# EAGLE design Kao Light Test Surface Mount (EAGLE 9.6.2)
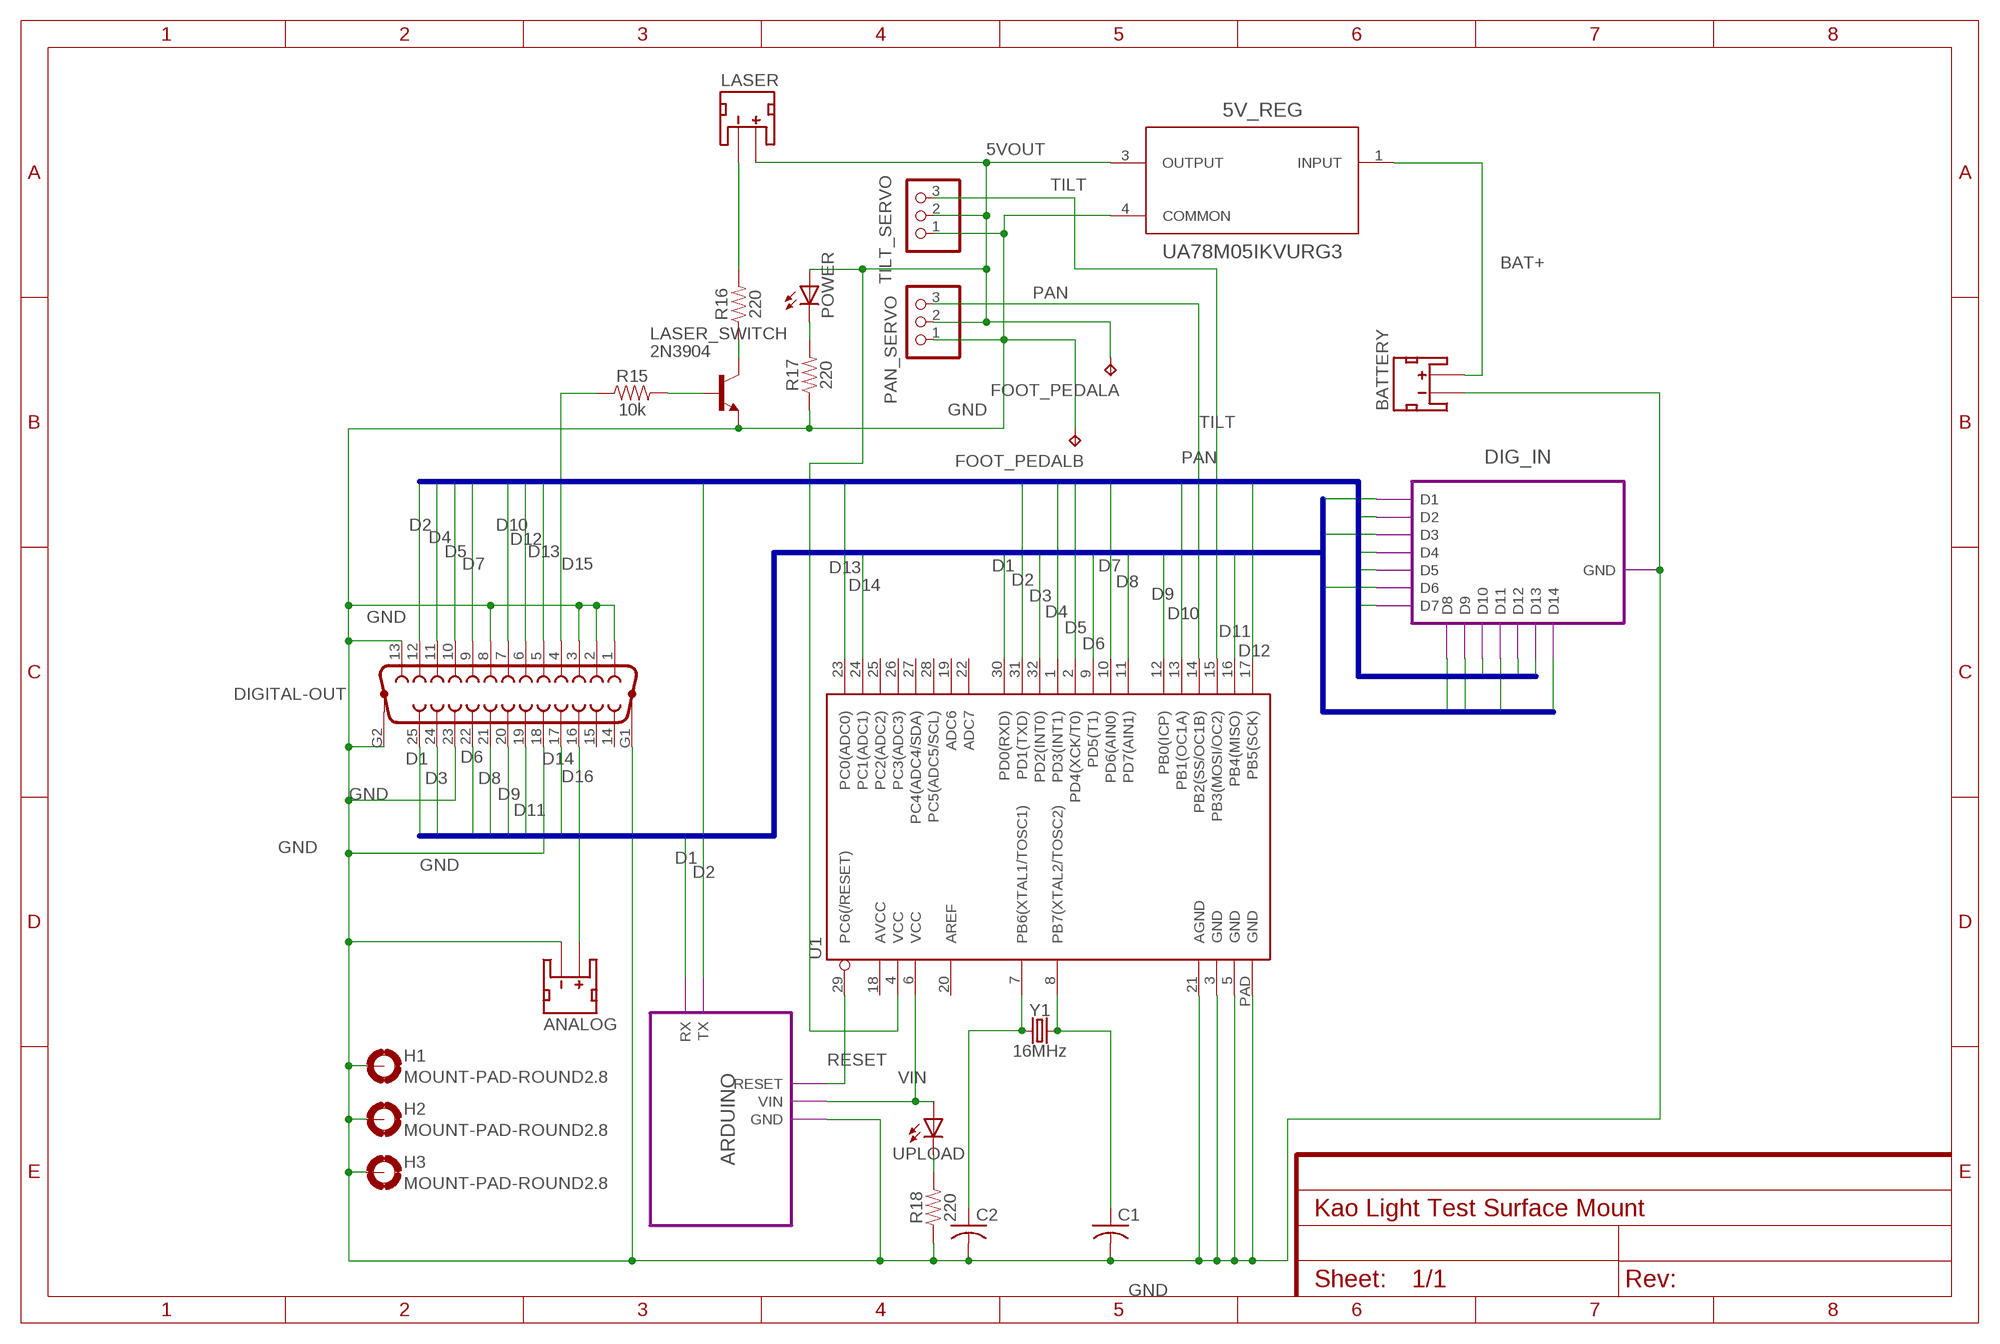
[diagram p0: schematic, sheet 1]

## Parts
5V_REG  UA78M05IKVURG3  [KVU0003A_N]
ANALOG  JST_2MM_MALE  [JST-2-SMD]
BATTERY  JST_2MM_MALE  [JST-2-SMD]
C1  C-USC0805K  [C0805K]
C2  C-USC0805K  [C0805K]
DIGITAL-OUT  F25VP  [F25VP]
FOOT_PEDAL  TP2P2-38-17  [P2-38-17]
H1  MOUNT-PAD-ROUND2.8  [2,8-PAD]
H2  MOUNT-PAD-ROUND2.8  [2,8-PAD]
H3  MOUNT-PAD-ROUND2.8  [2,8-PAD]
LASER  JST_2MM_MALE  [JST-2-SMD]
LASER_SWITCH  2N3904  2N2222  [TO92-EBC-OVAL]
PAN_SERVO  PINHD-1X3CB  [1X03-CLEANBIG]
POWER  LEDCHIPLED_0805  [CHIPLED_0805]
R15  10k  10KOHM-0603-1/10W-1%  [0603]
R16  220  200OHM-0603-1/10W-1%  [0603]
R17  220  200OHM-0603-1/10W-1%  [0603]
R18  220  200OHM-0603-1/10W-1%  [0603]
TILT_SERVO  PINHD-1X3CB  [1X03-CLEANBIG]
U1  ATMEGA328P_MLFMLF32  [MLF32-PAD]
UPLOAD  LEDCHIPLED_0805  [CHIPLED_0805]
Y1  16MHz  CRYSTAL-16MHZSMD-5X3.2  [CRYSTAL-SMD-5X3.2-4PAD]

## Module instances
DIG_IN = PULL_DOWN_RESISTORS
ARDUINO = PROGRAMMER

## Nets
5VOUT: 5V_REG.3(OUTPUT) FOOT_PEDAL.TP-1 LASER.2(+) PAN_SERVO.2 POWER.A TILT_SERVO.2 U1.4(VCC)
BAT+: 5V_REG.1(INPUT) BATTERY.2(+)
D1: DIGITAL-OUT.25 U1.30(PD0(RXD)) ; port DIG_IN.D1 ARDUINO.RX
D2: DIGITAL-OUT.12 U1.31(PD1(TXD)) ; port DIG_IN.D2 ARDUINO.TX
D3: DIGITAL-OUT.24 U1.32(PD2(INT0)) ; port DIG_IN.D3
D4: DIGITAL-OUT.11 U1.1(PD3(INT1)) ; port DIG_IN.D4
D5: DIGITAL-OUT.10 U1.2(PD4(XCK/T0)) ; port DIG_IN.D5
D6: DIGITAL-OUT.22 U1.9(PD5(T1)) ; port DIG_IN.D6
D7: DIGITAL-OUT.9 U1.10(PD6(AIN0)) ; port DIG_IN.D7
D8: DIGITAL-OUT.21 U1.11(PD7(AIN1)) ; port DIG_IN.D8
D9: DIGITAL-OUT.20 U1.12(PB0(ICP)) ; port DIG_IN.D9
D10: DIGITAL-OUT.7 U1.13(PB1(OC1A)) ; port DIG_IN.D10
D11: DIGITAL-OUT.19 U1.16(PB4(MISO)) ; port DIG_IN.D11
D12: DIGITAL-OUT.6 U1.17(PB5(SCK)) ; port DIG_IN.D12
D13: DIGITAL-OUT.5 U1.23(PC0(ADC0)) ; port DIG_IN.D13
D14: DIGITAL-OUT.17 U1.24(PC1(ADC1)) ; port DIG_IN.D14
D15: DIGITAL-OUT.4 R15.1
D16: ANALOG.2(+) DIGITAL-OUT.16
GND: 5V_REG.4(COMMON) ANALOG.1(-) BATTERY.1(-) C1.2 C2.2 DIGITAL-OUT.1 DIGITAL-OUT.2 DIGITAL-OUT.3 DIGITAL-OUT.8 DIGITAL-OUT.13 DIGITAL-OUT.18 DIGITAL-OUT.23 DIGITAL-OUT.G1 DIGITAL-OUT.G2 FOOT_PEDAL.TP-2 H1.B2,8(MOUNT) H2.B2,8(MOUNT) H3.B2,8(MOUNT) LASER_SWITCH.E PAN_SERVO.1 R17.1 R18.1 TILT_SERVO.1 U1.3(GND) U1.5(GND) U1.21(AGND) U1.PAD(GND) ; port DIG_IN.GND ARDUINO.GND
N$1: C2.1 U1.7(PB6(XTAL1/TOSC1)) Y1.1
N$2: LASER_SWITCH.B R15.2
N$3: LASER_SWITCH.C R16.1
N$4: C1.1 U1.8(PB7(XTAL2/TOSC2)) Y1.3
N$5: POWER.C R17.2
N$6: LASER.1(-) R16.2
N$7: R18.2 UPLOAD.C
PAN: PAN_SERVO.3 U1.14(PB2(SS/OC1B))
RESET: U1.29(PC6(/RESET)) ; port ARDUINO.RESET
TILT: TILT_SERVO.3 U1.15(PB3(MOSI/OC2))
VIN: U1.6(VCC) UPLOAD.A ; port ARDUINO.VIN
Unconnected: ANALOG.NC1(PAD1) ANALOG.NC2(PAD2) BATTERY.NC1(PAD1) BATTERY.NC2(PAD2) DIGITAL-OUT.14 DIGITAL-OUT.15 LASER.NC1(PAD1) LASER.NC2(PAD2) U1.18(AVCC) U1.19(ADC6) U1.20(AREF) U1.22(ADC7) U1.25(PC2(ADC2)) U1.26(PC3(ADC3)) U1.27(PC4(ADC4/SDA)) U1.28(PC5(ADC5/SCL))

## Buses
TOP_DIGITAL_OUTPUTS:D2,D4,D5,D7,D10,D12,D13
BOTTOM_DIGITAL_OUTPUTS:D1,D3,D6,D8,D9,D11,D14

## Library data of the parts
5V_REG = UA78M05IKVURG3:UA78M05IKVURG3; COPYRIGHT: Copyright (C) 2021 Ultra Librarian. All rights reserved.; DIGI-KEY_PART_NUMBER_1: 296-21206-1-ND; DIGI-KEY_PART_NUMBER_2: 296-21206-2-ND; DIGI-KEY_PART_NUMBER_3: 296-21206-6-ND; DIGI-KEY_PART_NUMBER_4: 2156-UA78M05IKVURG3-ND; MANUFACTURER_PART_NUMBER: UA78M05IKVURG3; MFR_NAME: Texas Instruments; REFDES: RefDes; TYPE: TYPE
ANALOG BATTERY LASER = SparkFun-Connectors:JST_2MM_MALE: JST 2MM MALE RA CONNECTOR Two pin, compact surface mount connector. Commonly used as a battery input connection point. We really like the solid locking feeling and high current rating on these small connectors. We use these all the time as battery connectors. Mates to single-cell LiPo batteries. Here is the connector we sell at SparkFun: JST Right Angle Connector - White <https://www.sparkfun.com/products/8612> (PRT-08612) Datasheet <http://www.sparkfun.com/datasheets/Prototyping/Connectors/JST-Horizontal.pdf> It was used on these SparkFun products: SparkFun MOSFET Power Controller <https://www.sparkfun.com/products/11214> (PRT-11214) SparkFun Battery Babysitter - LiPo Battery Manager <https://www.sparkfun.com/products/13777> (PRT-13777) And many, many others that required a lipo battery connection.; PROD_ID: CONN-11443; SF_ID: PRT-08612
C1 C2 = adafruit:C-US: CAPACITOR, American symbol
DIGITAL-OUT = con-subd:F25VP: SUB-D; OC_FARNELL: unknown; OC_NEWARK: unknown
FOOT_PEDAL = testpad:TP2: Test pad
H1-H3 = holes:MOUNT-PAD-ROUND: MOUNTING PAD, round
LASER_SWITCH = adafruit:2N2222: NPN TRANSISTOR Big oval pads
PAN_SERVO TILT_SERVO = adafruit:PINHD-1X3: PIN HEADER
POWER UPLOAD = adafruit:LED: LED OSRAM: - CHIPLED LG R971, LG N971, LY N971, LG Q971, LY Q971, LO R971, LY R971 LH N974, LH R974 LS Q976, LO Q976, LY Q976 LO Q996 - Hyper CHIPLED LW Q18S LB Q993, LB Q99A, LB R99A - SideLED LS A670, LO A670, LY A670, LG A670, LP A670 LB A673, LV A673, LT A673, LW A673 LH A674 LY A675 LS A676, LA A676, LO A676, LY A676, LW A676 LS A679, LY A679, LG A679 - Hyper Micro SIDELED® LS Y876, LA Y876, LO Y876, LY Y876 LT Y87S - SmartLED LW L88C, LW L88S LB L89C, LB L89S, LG L890 LS L89K, LO L89K, LY L89K LS L896, LA L896, LO L896, LY L896 - TOPLED LS T670, LO T670, LY T670, LG T670, LP T670 LSG T670, LSP T670, LSY T670, LOP T670, LYG T670 LG T671, LOG T671, LSG T671 LB T673, LV T673, LT T673, LW T673 LH T674 LS T676, LA T676, LO T676, LY T676, LB T676, LH T676, LSB T676, LW T676 LB T67C, LV T67C, LT T67C, LS T67K, LO T67K, LY T67K, LW E67C LS E67B, LA E67B, LO E67B, LY E67B, LB E67C, LV E67C, LT E67C LW T67C LS T679, LY T679, LG T679 LS T770, LO T770, LY T770, LG T770, LP T770 LB T773, LV T773, LT T773, LW T773 LH T774 LS E675, LA E675, LY E675, LS T675 LS T776, LA T776, LO T776, LY T776, LB T776 LHGB T686 LT T68C, LB T68C - Hyper Mini TOPLED® LB M676 - Mini TOPLED Santana® LG M470 LS M47K, LO M47K, LY M47K Source: http://www.osram.convergy.de/
R15 = SparkFun-Resistors:10KOHM: 10kΩ resistor A resistor is a passive two-terminal electrical component that implements electrical resistance as a circuit element. Resistors act to reduce current flow, and, at the same time, act to lower voltage levels within circuits. - Wikipedia; PROD_ID: RES-00824
R16-R18 = SparkFun-Resistors:200OHM: 200Ω resistor A resistor is a passive two-terminal electrical component that implements electrical resistance as a circuit element. Resistors act to reduce current flow, and, at the same time, act to lower voltage levels within circuits. - Wikipedia; PROD_ID: RES-08220; VALUE: 200
U1 = SparkFun-IC-Microcontroller:ATMEGA328P_MLF: Datasheet SparkFun Products () () 32-Pin Atmega328 part Commonly used on Arduino compatible boards Available in QFP and QFN packages TQFP is IC-09069 QFN is non-stock
Y1 = SparkFun-Clocks:CRYSTAL-16MHZ: 16MHz Crystal Digikey Example <http://www.digikey.com/product-search/en?keywords=535-9122-1-ND> Frequency: 16MHz Frequency Stability: ±50ppm Frequency Tolerance: ±20ppm Load Capacitance: 18pF SparkFun Products: Pro Micro -5V/16MHz <https://www.sparkfun.com/products/12640> SparkFun Serial Enabled LCD Kit <https://www.sparkfun.com/products/10097>; PROD_ID: XTAL-08218; SF_ID: COM-00094

## Module PULL_DOWN_RESISTORS
Ports: D1(in) D2(in) D3(in) D4(in) D5(in) D6(in) D7(in) D8(in) D9(in) D10(in) D11(in) D12(in) GND(out) D13(in) D14(in)
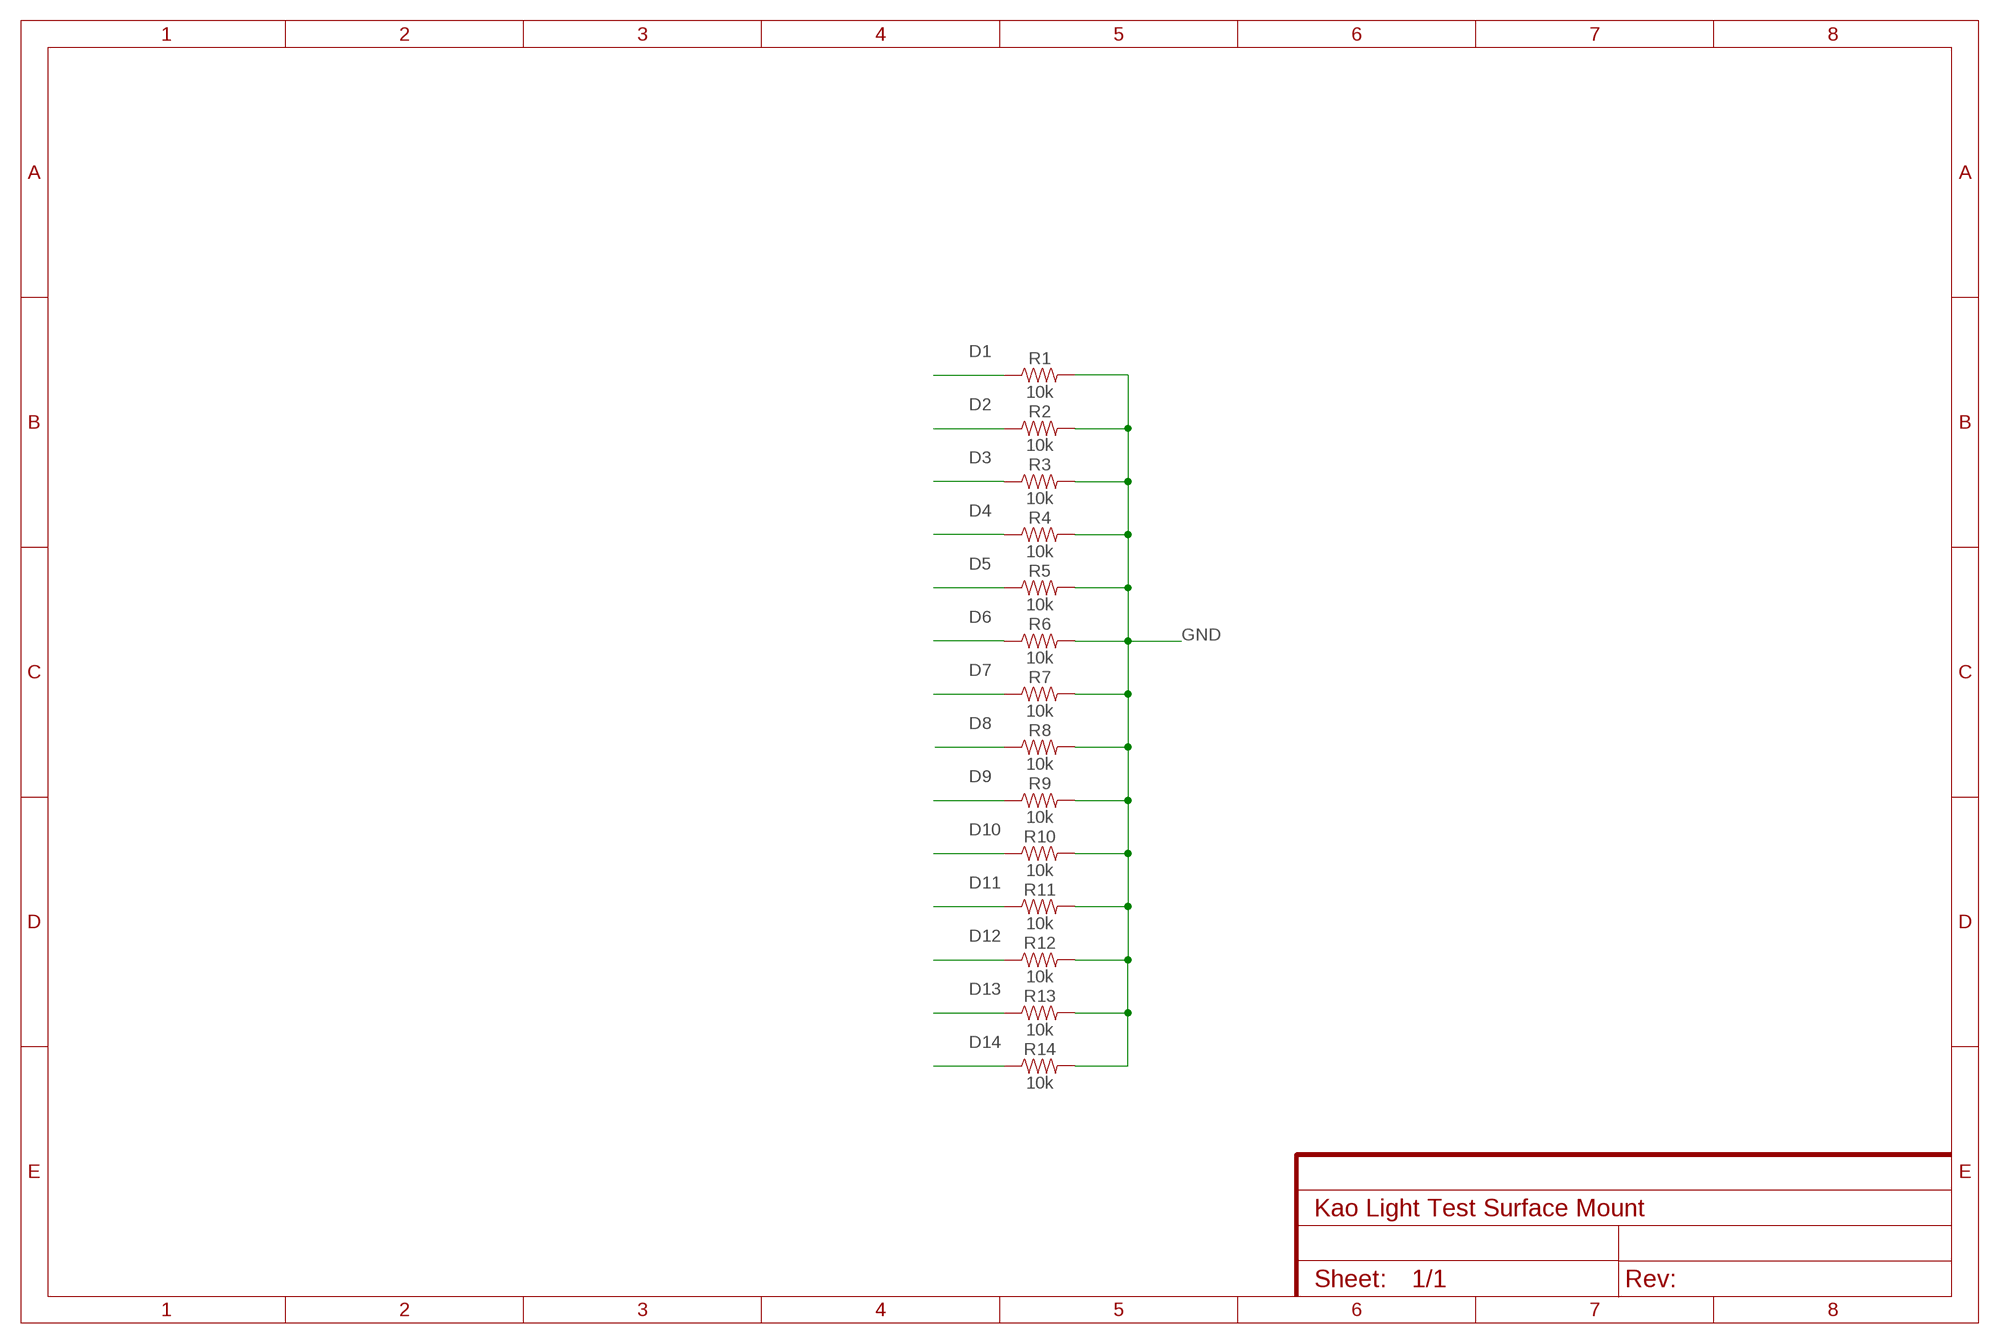
[diagram p1: schematic, module PULL_DOWN_RESISTORS, sheet 1]

### Parts
R1  10k  10KOHM-0603-1/10W-1%  [0603]
R2  10k  10KOHM-0603-1/10W-1%  [0603]
R3  10k  10KOHM-0603-1/10W-1%  [0603]
R4  10k  10KOHM-0603-1/10W-1%  [0603]
R5  10k  10KOHM-0603-1/10W-1%  [0603]
R6  10k  10KOHM-0603-1/10W-1%  [0603]
R7  10k  10KOHM-0603-1/10W-1%  [0603]
R8  10k  10KOHM-0603-1/10W-1%  [0603]
R9  10k  10KOHM-0603-1/10W-1%  [0603]
R10  10k  10KOHM-0603-1/10W-1%  [0603]
R11  10k  10KOHM-0603-1/10W-1%  [0603]
R12  10k  10KOHM-0603-1/10W-1%  [0603]
R13  10k  10KOHM-0603-1/10W-1%  [0603]
R14  10k  10KOHM-0603-1/10W-1%  [0603]

### Nets
D1: R1.1
D2: R2.1
D3: R3.1
D4: R4.1
D5: R5.1
D6: R6.1
D7: R7.1
D8: R8.1
D9: R9.1
D10: R10.1
D11: R11.1
D12: R12.1
D13: R13.1
D14: R14.1
GND: R1.2 R2.2 R3.2 R4.2 R5.2 R6.2 R7.2 R8.2 R9.2 R10.2 R11.2 R12.2 R13.2 R14.2

### Library data of the parts
R1-R14 = SparkFun-Resistors:10KOHM: 10kΩ resistor A resistor is a passive two-terminal electrical component that implements electrical resistance as a circuit element. Resistors act to reduce current flow, and, at the same time, act to lower voltage levels within circuits. - Wikipedia; PROD_ID: RES-00824

## Module PROGRAMMER
Ports: VIN(out) GND(in) RESET(out) RX(out) TX(out)
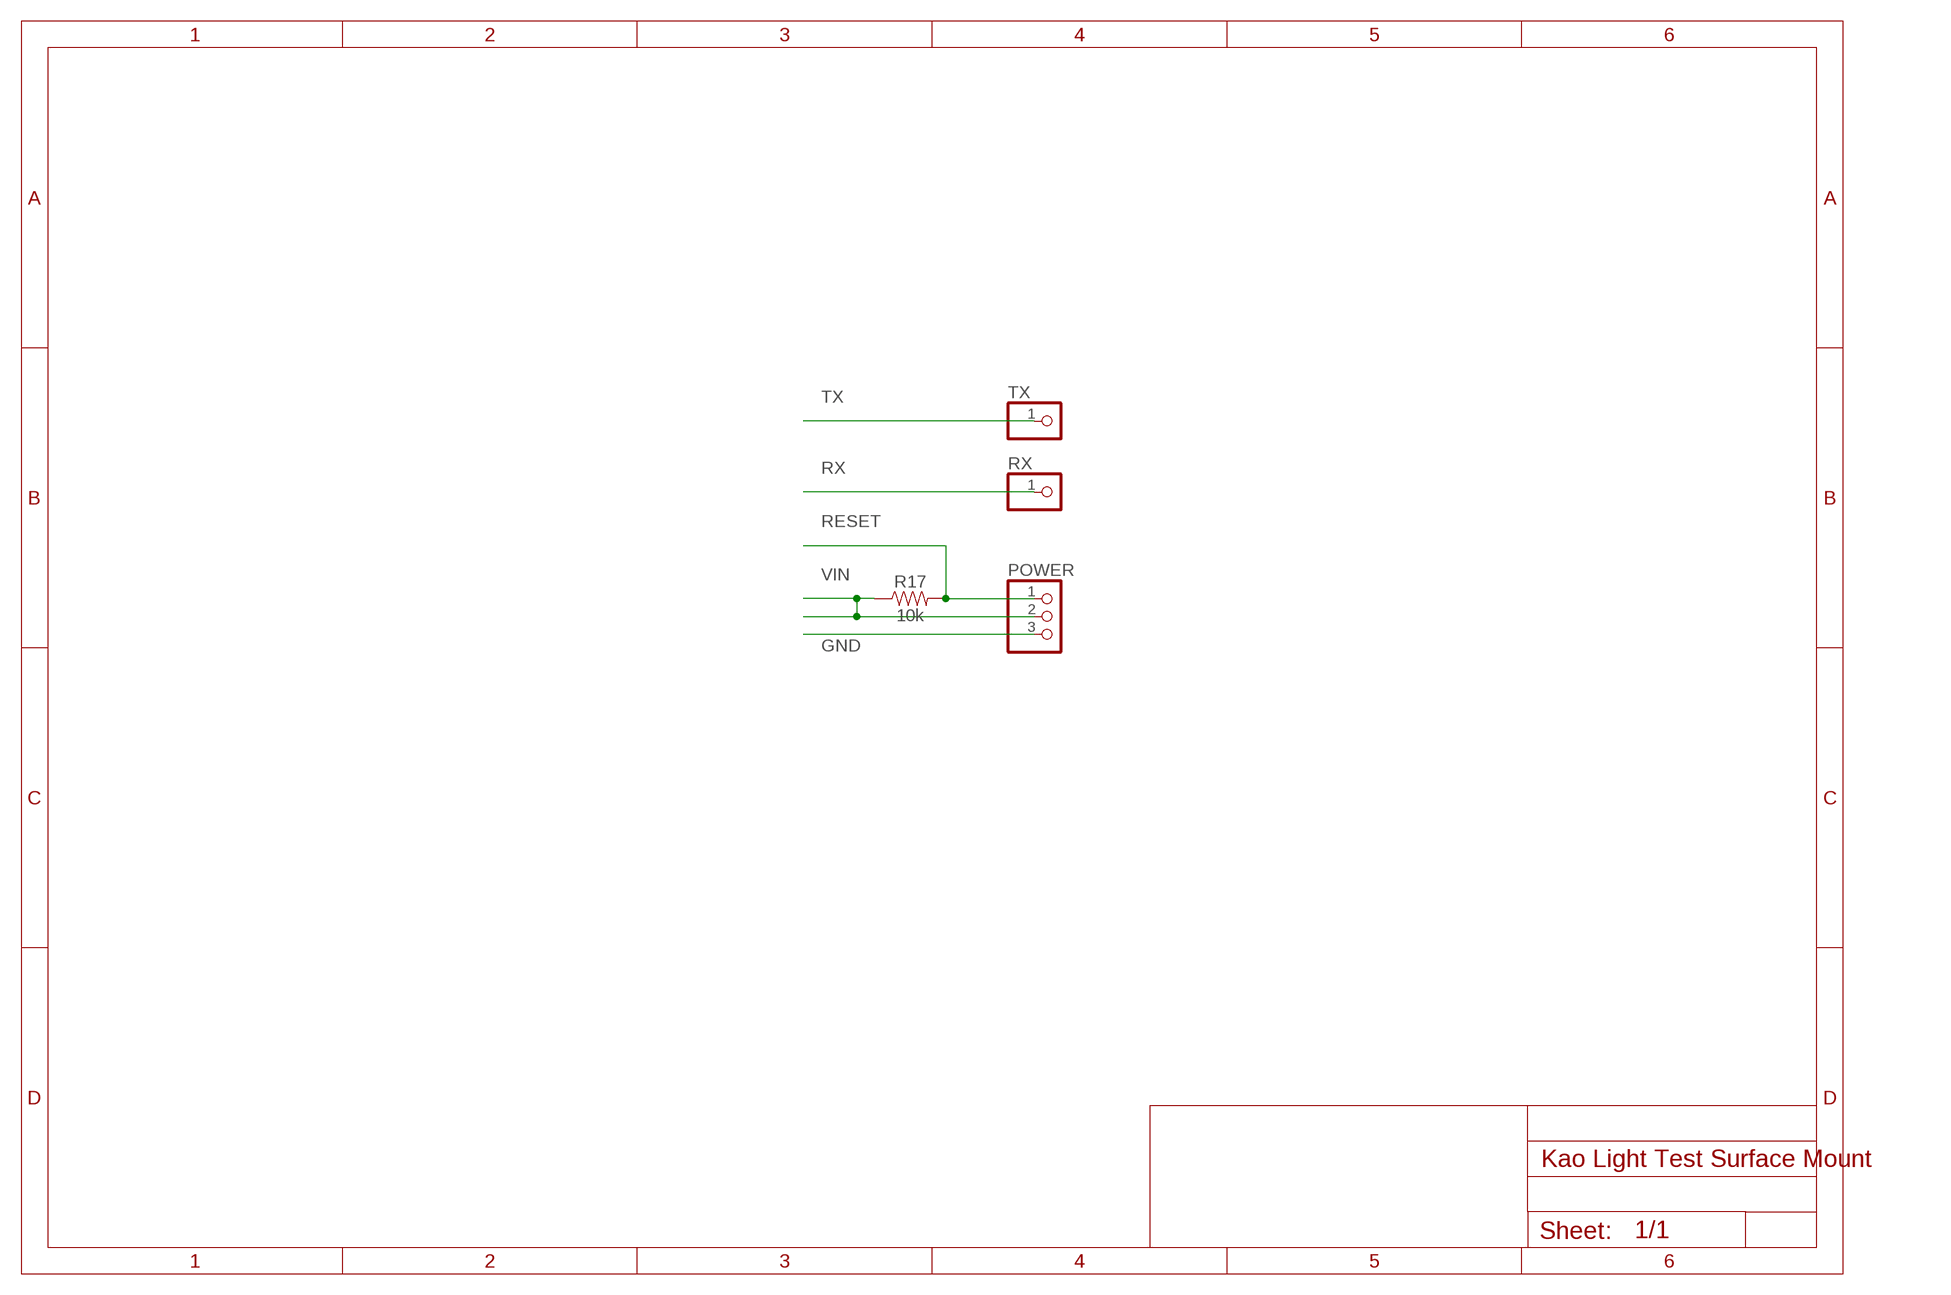
[diagram p2: schematic, module PROGRAMMER, sheet 1]

### Parts
POWER  PINHD-1X3CB  [1X03-CLEANBIG]
R17  10k  10KOHM-0603-1/10W-1%  [0603]
RX  PINHD-1X1CB  [1X01-CLEANBIG]
TX  PINHD-1X1CB  [1X01-CLEANBIG]

### Nets
GND: POWER.3
RESET: POWER.1 R17.2
RX: RX.1
TX: TX.1
VIN: POWER.2 R17.1

### Library data of the parts
POWER = adafruit:PINHD-1X3: PIN HEADER
R17 = SparkFun-Resistors:10KOHM: 10kΩ resistor A resistor is a passive two-terminal electrical component that implements electrical resistance as a circuit element. Resistors act to reduce current flow, and, at the same time, act to lower voltage levels within circuits. - Wikipedia; PROD_ID: RES-00824
RX TX = adafruit:PINHD-1X1: Pin header 1x1 for 0.1" spacing With round pins

## Net classes
0 default: width 0.254 mm

## Board
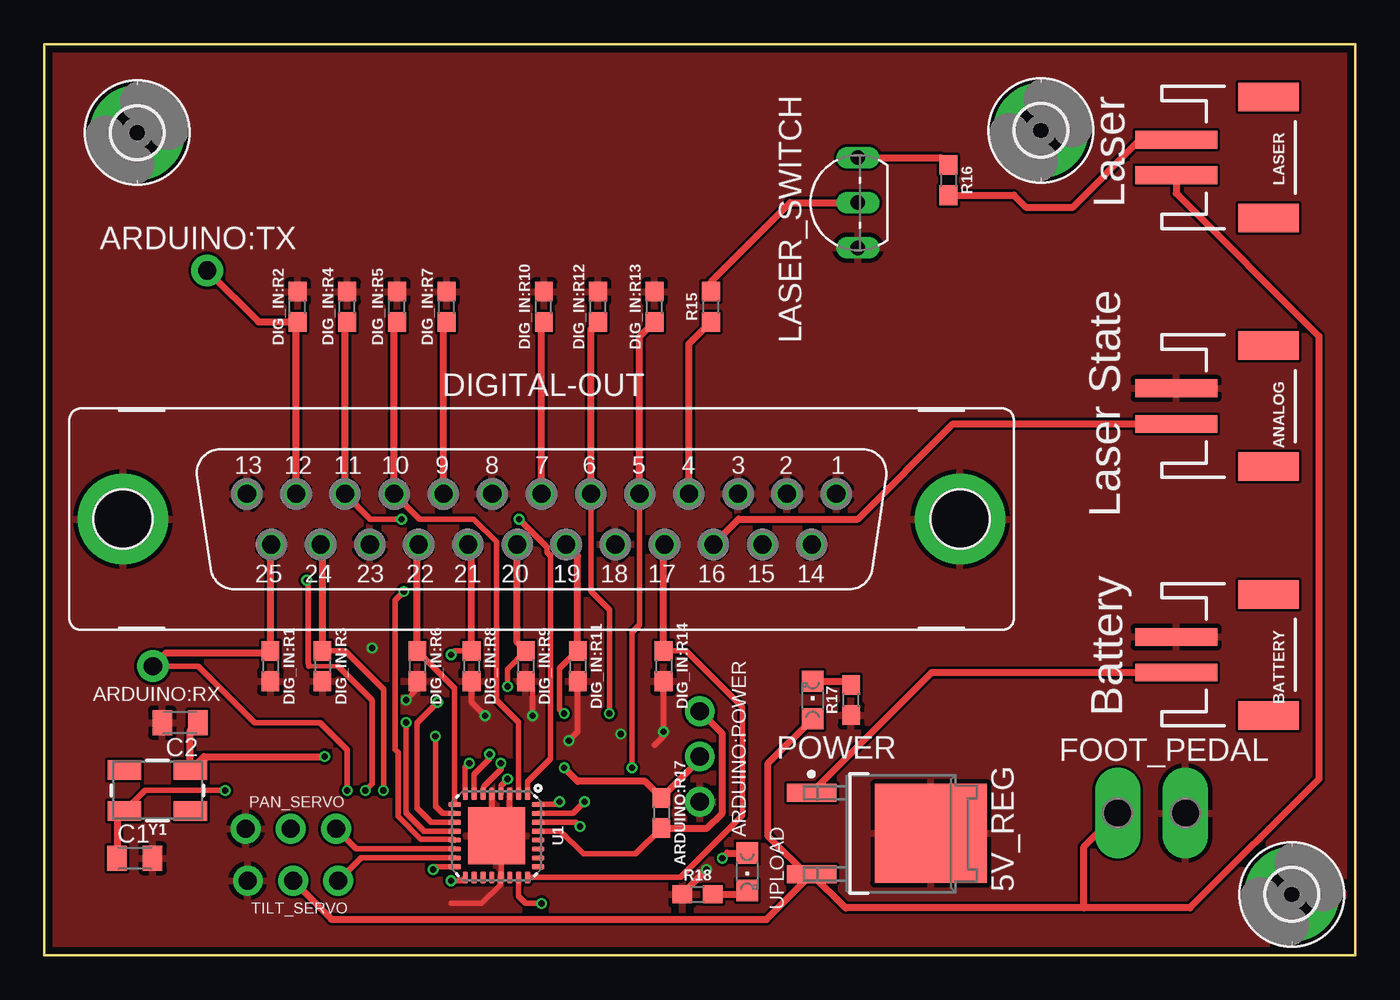
[diagram p3: board, top side]
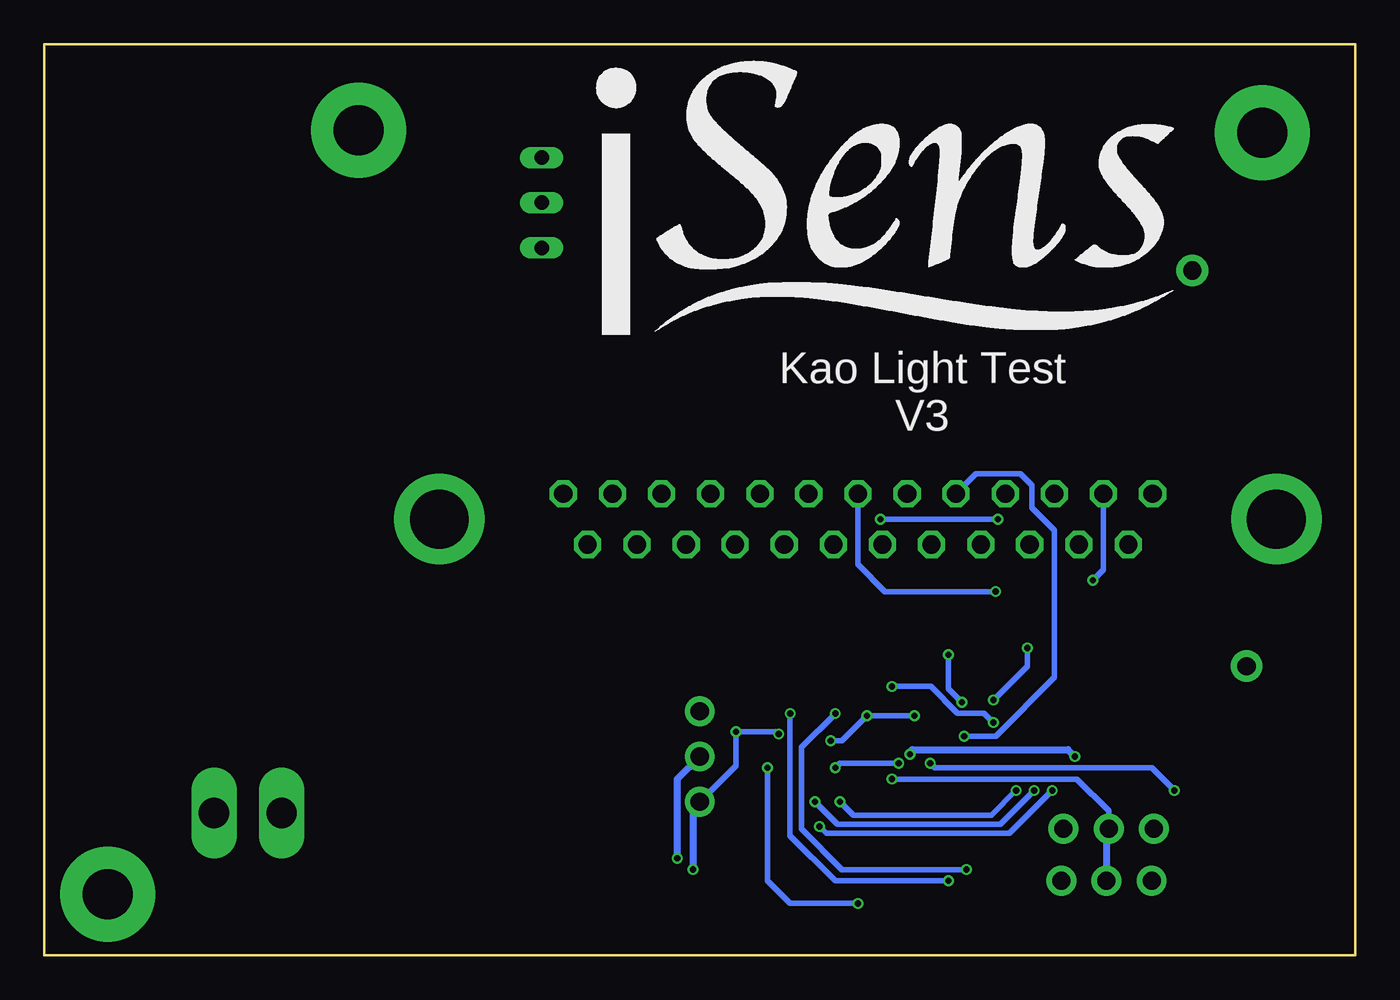
[diagram p4: board, bottom side, seen from below]

Size 73.66 x 51.18 mm. Coordinates in mm from the lower left corner, seen from the top.
Outline: 0,0 0,51.18 73.66,51.18 73.66,0 0,0
Copper layers (1*16): Top 0.035559375mm / dielectric 1.6mm / Bottom 0.035559375mm
Design rules "oshpark-2layer": minimum track width 6mil, minimum drill 10mil, track to track 6mil, track to pad 6mil, pad to pad 6mil, via to via 6mil, smd to smd 6mil, copper to edge 15mil, drill to drill 6mil, minimum pad ring 5mil, minimum via ring 5mil, stop-mask expansion 2.5mil, vias tented up to drill 0mil, thermal gap 10mil

### Footprints (pad centres in the part's own frame; a part is rotated, then mirrored left to right if it is on the bottom)
KVU0003A_N = smd 2.8 x 1: 1 -3.87,2.29; 3 -3.87,-2.29 | smd 6.3 x 5.55: 4 2.83,0
JST-2-SMD = smd 1 x 4.6: 1 -1,-3.7; 2 1,-3.7 | smd 1.6 x 3.4: NC1 -3.4,1.5; NC2 3.4,1.5
1X03-CLEANBIG = drill 1.016 pad 1.676: 1 -2.54,0; 2 0,0; 3 2.54,0
0603 = smd 1.1 x 1: 1 -0.85,0; 2 0.85,0
1X01-CLEANBIG = drill 1.016 pad 1.778: 1 0,0
C0805K = smd 1.1 x 1.4: 1 -1,0; 2 1,0
F25VP = drill 1.016 octagon: 1 16.561,1.422; 2 13.792,1.422; 3 11.049,1.422; 4 8.28,1.422; 5 5.512,1.422; 6 2.769,1.422; 7 0,1.422; 8 -2.769,1.422; 9 -5.512,1.422; 10 -8.28,1.422; 11 -11.049,1.422; 12 -13.792,1.422; 13 -16.561,1.422; 14 15.189,-1.422; 15 12.421,-1.422; 16 9.652,-1.422; 17 6.909,-1.422; 18 4.14,-1.422; 19 1.372,-1.422; 20 -1.372,-1.422; 21 -4.14,-1.422; 22 -6.909,-1.422; 23 -9.652,-1.422; 24 -12.421,-1.422; 25 -15.189,-1.422 | drill 3.302 pad 5.08: G1 -23.52,0; G2 23.52,0
P2-38-17 = drill 1.702 pad 2.121 long: TP-1 -1.905,0; TP-2 1.905,0
2,8-PAD = drill 2.8 pad 5.334: B2,8 0,0
TO92-EBC-OVAL = drill 0.813 long: B 0,-1.27; C 2.54,-1.27; E -2.54,-1.27
CHIPLED_0805 = smd 1.2 x 1.2: A 0,-1.05; C 0,1.05
MLF32-PAD = smd 0.7 x 0.3: 1 -2.35,1.75; 2 -2.35,1.25; 3 -2.35,0.75; 4 -2.35,0.25; 5 -2.35,-0.25; 6 -2.35,-0.75; 7 -2.35,-1.25; 8 -2.35,-1.75; 17 2.35,-1.75; 18 2.35,-1.25; 19 2.35,-0.75; 20 2.35,-0.25; 21 2.35,0.25; 22 2.35,0.75; 23 2.35,1.25; 24 2.35,1.75 | smd 0.3 x 0.7: 9 -1.75,-2.35; 10 -1.25,-2.35; 11 -0.75,-2.35; 12 -0.25,-2.35; 13 0.25,-2.35; 14 0.75,-2.35; 15 1.25,-2.35; 16 1.75,-2.35; 25 1.75,2.35; 26 1.25,2.35; 27 0.75,2.35; 28 0.25,2.35; 29 -0.25,2.35; 30 -0.75,2.35; 31 -1.25,2.35; 32 -1.75,2.35 | smd 3.2 x 3.2: PAD 0,0
CRYSTAL-SMD-5X3.2-4PAD = smd 1.9 x 1.1: 1 -1.85,-1.15; 2 1.85,-1.15; 3 1.85,1.15; 4 -1.85,1.15

### Placement (x,y rotation side)
5V_REG  46.99,6.86 0 top
ANALOG  67.31,30.86 270 top
ARDUINO:POWER  [1X03-CLEANBIG]  36.83,11.18 270 top
ARDUINO:R17  10k  [0603]  34.67,8 270 top
ARDUINO:RX  [1X01-CLEANBIG]  6.1,16.26 0 top
ARDUINO:TX  [1X01-CLEANBIG]  9.14,38.48 0 top
BATTERY  67.31,16.89 270 top
C1  5.08,5.46 0 top
C2  7.62,13.08 180 top
DIG_IN:R1  10k  [0603]  12.7,16.26 270 top
DIG_IN:R2  10k  [0603]  14.22,36.45 90 top
DIG_IN:R3  10k  [0603]  15.62,16.26 270 top
DIG_IN:R4  10k  [0603]  17.02,36.45 90 top
DIG_IN:R5  10k  [0603]  19.81,36.45 90 top
DIG_IN:R6  10k  [0603]  20.95,16.26 270 top
DIG_IN:R7  10k  [0603]  22.61,36.45 90 top
DIG_IN:R8  10k  [0603]  24,16.26 270 top
DIG_IN:R9  10k  [0603]  27.05,16.26 270 top
DIG_IN:R10  10k  [0603]  28.07,36.45 90 top
DIG_IN:R11  10k  [0603]  29.97,16.26 270 top
DIG_IN:R12  10k  [0603]  31.11,36.45 90 top
DIG_IN:R13  10k  [0603]  34.29,36.45 90 top
DIG_IN:R14  10k  [0603]  34.8,16.26 270 top
DIGITAL-OUT  27.94,24.51 0 top
FOOT_PEDAL  62.23,8 0 top
H1  5.21,46.23 0 top
H2  56.01,46.36 0 top
H3  70.1,3.43 0 top
LASER  67.31,44.83 270 top
LASER_SWITCH  44.45,42.29 90 top
PAN_SERVO  13.84,7.11 0 top
POWER  43.18,14.35 0 top
R15  37.47,36.45 90 top
R16  50.8,43.56 270 top
R17  45.34,14.35 90 top
R18  36.7,3.43 0 top
TILT_SERVO  13.97,4.19 0 top
U1  25.4,6.73 270 top
UPLOAD  39.5,4.7 180 top
Y1  6.35,9.27 180 top

### Tracks (layer width: path | path; a pad name or v marks a point on that pad's centre or on a via)
5VOUT  (via drill 0.35)
  Top 0.305: U1.4 25.65,9.52 v26.04,9.91
  Top 0.406: TILT_SERVO.2 16.13,2.03 40.58,2.03 42.96,4.41 | 42.96,4.41 5V_REG.3 45.02,2.67 58.42,2.67 | LASER.2 63.61,42.82 71.63,34.8 71.63,9.91 64.39,2.67 58.42,2.67 | POWER.A 40.64,10.76 40.64,6.73 42.96,4.41 | 58.42,2.67 58.42,6.1 FOOT_PEDAL.TP-1
  Bottom 0.305: PAN_SERVO.2 13.84,8.13 15.62,9.91 v26.04,9.91
  Bottom 0.406: PAN_SERVO.2 13.97,6.98 TILT_SERVO.2
BAT+
  Top 0.406: BATTERY.2 49.86,15.89 5V_REG.1
D1  (via drill 0.35)
  Top 0.305: DIG_IN:R1.1 12.81,17 | v17.02,9.27 17.02,11.56 15.49,13.08 11.81,13.08 8.64,16.26 ARDUINO:RX.1 | U1.30 29.86,7.48 v30.1,7.24
  Top 0.406: DIG_IN:R1.1 12.7,23.04 DIGITAL-OUT.25 | ARDUINO:RX.1 6.84,17 12.81,17
  Bottom 0.305: v17.02,9.27 19.43,6.86 29.72,6.86 v30.1,7.24
D2  (via drill 0.35)
  Top 0.254: 14.86,16.26 16.51,16.26
  Top 0.305: v18.03,9.27 18.41,9.65 18.41,14.35 16.51,16.26 | U1.31 29.7,7.98 v30.35,8.64 | 14.86,16.26 14.86,16.39 14.82,16.43 14.82,21 v14.73,21.08
  Top 0.406: DIGITAL-OUT.12 14.15,35.52 DIG_IN:R2.1 12.03,35.6 ARDUINO:TX.1
  Bottom 0.305: v18.03,9.27 19.94,7.37 29.08,7.37 v30.35,8.64 | v14.73,21.08 14.15,21.67 DIGITAL-OUT.12
D3  (via drill 0.35)
  Top 0.305: DIG_IN:R3.1 16.89,17.11 19.05,14.95 v19.05,9.27 | U1.32 28.8,8.48 v28.96,8.64
  Top 0.406: DIG_IN:R3.1 15.62,22.99 DIGITAL-OUT.24
  Bottom 0.305: v19.05,9.27 20.45,7.87 28.19,7.87 v28.96,8.64
D4  (via drill 0.35)
  Top 0.305: DIGITAL-OUT.11 18.31,24.51 v20.07,24.51 | v26.67,24.51 28.25,22.94 28.25,22.65 28.45,22.44 28.45,11.05 27.15,9.75 U1.1
  Top 0.406: DIGITAL-OUT.11 16.89,35.47 DIG_IN:R4.1
  Bottom 0.305: v20.07,24.51 v26.67,24.51
D5
  Top 0.305: U1.2 26.65,13.1 25.4,14.35 25.4,23.24 24.13,24.51 21.08,24.51 DIGITAL-OUT.10
  Top 0.406: DIGITAL-OUT.10 19.66,35.45 DIG_IN:R5.1
D6
  Top 0.305: DIG_IN:R6.1 23.05,15.01 U1.9
  Top 0.406: DIG_IN:R6.1 20.95,23.01 DIGITAL-OUT.22
D7  (via drill 0.35)
  Top 0.305: U1.10 22.37,7.98 21.97,8.38 v21.97,12.32
  Top 0.406: DIGITAL-OUT.9 22.43,35.42 DIG_IN:R7.1
  Bottom 0.305: DIGITAL-OUT.9 21.31,27.05 18.8,27.05 18.16,26.42 18.16,25.15 16.89,23.88 16.89,15.62 20.19,12.32 v21.97,12.32
D8  (via drill 0.35)
  Top 0.305: U1.11 21.73,7.48 20.95,8.26 20.95,13.08 v22.1,14.22 | v22.86,16.89 23.07,17.11 DIG_IN:R8.1
  Top 0.406: DIG_IN:R8.1 24,22.89 DIGITAL-OUT.21
  Bottom 0.305: v22.1,14.22 22.86,14.99 v22.86,16.89
D9  (via drill 0.35)
  Top 0.305: U1.12 21.34,6.98 20.32,8 v20.32,13.08 | v26.04,15.11 26.04,16.09 DIG_IN:R9.1
  Top 0.406: DIG_IN:R9.1 26.57,17.59 DIGITAL-OUT.20
  Bottom 0.305: v20.32,13.08 20.86,13.62 22.35,13.62 23.84,15.11 v26.04,15.11
D10  (via drill 0.35)
  Top 0.305: U1.13 23.01,6.52 21.15,6.52 19.86,7.81 19.86,11.41 19.71,11.56 19.71,19.97 v20.19,20.45
  Top 0.406: DIGITAL-OUT.7 27.94,35.47 DIG_IN:R10.1
  Bottom 0.305: v20.19,20.45 26.42,20.45 27.94,21.97 DIGITAL-OUT.7
D11  (via drill 0.35)
  Top 0.305: U1.16 22,4.98 v21.84,4.83 | v29.21,13.59 28.96,13.84 28.96,16.13 29.93,17.11 DIG_IN:R11.1
  Top 0.406: DIG_IN:R11.1 29.97,22.43 DIGITAL-OUT.19
  Bottom 0.305: v21.84,4.83 28.83,4.83 31.11,7.11 31.11,11.68 v29.21,13.59
D12  (via drill 0.35)
  Top 0.305: DIGITAL-OUT.6 30.71,20.47 31.75,19.43 v31.75,13.59 | U1.17 23.46,4.19 v22.86,4.19
  Top 0.406: DIGITAL-OUT.6 30.71,35.19 DIG_IN:R12.1
  Bottom 0.305: v31.75,13.59 31.75,6.73 29.21,4.19 v22.86,4.19
D13  (via drill 0.35)
  Top 0.305: DIGITAL-OUT.5 33.45,18.59 33.02,18.16 v33.02,10.54 | v27.94,2.92 27.05,2.92 26.65,3.32 U1.23
  Top 0.406: DIGITAL-OUT.5 33.45,34.76 DIG_IN:R13.1
  Bottom 0.305: v33.02,10.54 33.02,4.19 31.75,2.92 v27.94,2.92
D14
  Top 0.305: DIG_IN:R14.1 36.07,17.11 39.24,13.93 39.24,7.87 35.75,4.38 U1.24
  Top 0.406: DIG_IN:R14.1 34.8,23.04 DIGITAL-OUT.17
D15
  Top 0.406: DIGITAL-OUT.4 36.22,34.35 R15.1
D16
  Top 0.406: DIGITAL-OUT.16 39.01,24.51 45.72,24.51 51.07,29.86 ANALOG.2
GND  (via drill 0.35)
  Top 0.254: U1.5
  Top 0.305: DIG_IN:R9.2 27.43,15.03 v27.43,13.46 | DIG_IN:R11.2 29.97,12.57 v29.46,12.06 | 25.15,6.98 U1.PAD 25.65,6.48 U1.21 25.61,4.34 25.61,3.95 24.58,2.92 22.86,2.92 | DIG_IN:R14.2 v34.8,12.57 34.8,12.32 34.29,11.81 | U1.3 26.15,7.98 25.15,6.98 | v24.77,13.46 24,14.22 DIG_IN:R8.2 | DIG_IN:R6.2 20.95,14.99 v20.32,14.35 | U1.5 25.15,6.98
  Top 0.406: v37.21,4.83 35.85,3.47 R18.1
  Bottom 0.305: v29.46,12.06 28.83,12.06 v27.43,13.46 v24.77,13.46 | ARDUINO:POWER.3 34.8,10.67 v34.8,12.57 32.51,12.57 v32.38,12.45 | v20.32,14.35 18.41,16.26 v18.41,17.27
  Bottom 0.406: ARDUINO:POWER.3 37.21,8.26 v37.21,4.83
  pour Top: -3.81,57.53 74.93,57.53 76.2,56.26 76.2,1.65 68.58,-5.97 -6.35,-5.97 -6.35,54.99
N$1  (via drill 0.35)
  Top 0.305: U1.7 24.15,10.18 25.02,11.05 v25.02,11.3
  Top 0.406: C2.1 8.2,12.66 Y1.1 8.96,11.18 v15.75,11.18
  Bottom 0.406: v25.02,11.3 25.02,11.43 24.89,11.56 16.13,11.56 v15.75,11.18
N$2
  Top 0.406: R15.2 37.47,37.85 41.91,42.29 LASER_SWITCH.B
N$3
  Top 0.406: LASER_SWITCH.C 50.38,44.83 R16.1
N$4  (via drill 0.35)
  Top 0.305: U1.8 23.65,10.57 v23.88,10.79 | v10.16,9.27 5.65,9.27 Y1.3
  Top 0.406: Y1.3 4.08,7.7 C1.1
  Bottom 0.305: v23.88,10.79 23.62,10.54 11.43,10.54 v10.16,9.27
N$5
  Top 0.406: POWER.C 45.14,15.4 R17.2
N$6
  Top 0.406: R16.2 54.5,42.71 55.19,42.02 57.77,42.02 61.58,45.83 LASER.1
N$7
  Top 0.406: R18.2 39.28,3.43 UPLOAD.C
PAN
  Top 0.305: U1.14 17.51,5.98 PAN_SERVO.3
RESET
  Top 0.305: U1.29 29.02,6.98 30.29,5.71 33.23,5.71 ARDUINO:R17.2
  Top 0.406: ARDUINO:R17.2 37.25,7.15 38.1,8 38.1,12.45 ARDUINO:POWER.1
TILT
  Top 0.305: U1.15 17.8,5.48 TILT_SERVO.3
VIN  (via drill 0.35)
  Top 0.254: U1.6 24.65,9.47 24.7,9.51
  Top 0.305: v25.65,10.79 25.65,10.47 24.7,9.51
  Top 0.406: ARDUINO:POWER.2 36.83,11.01 ARDUINO:R17.1 33.74,9.78 29.97,9.78 v29.21,10.54 | v38.1,5.46 38.39,5.75 UPLOAD.A
  Bottom 0.305: v25.65,10.79 28.96,10.79 v29.21,10.54
  Bottom 0.406: ARDUINO:POWER.2 38.1,9.91 v38.1,5.46

### Text on the board
tPlace: Laser State | Battery
tNames: Laser
bNames: Kao Light Test / V3